# EAGLE schematic RFID (EAGLE 8.3.1)
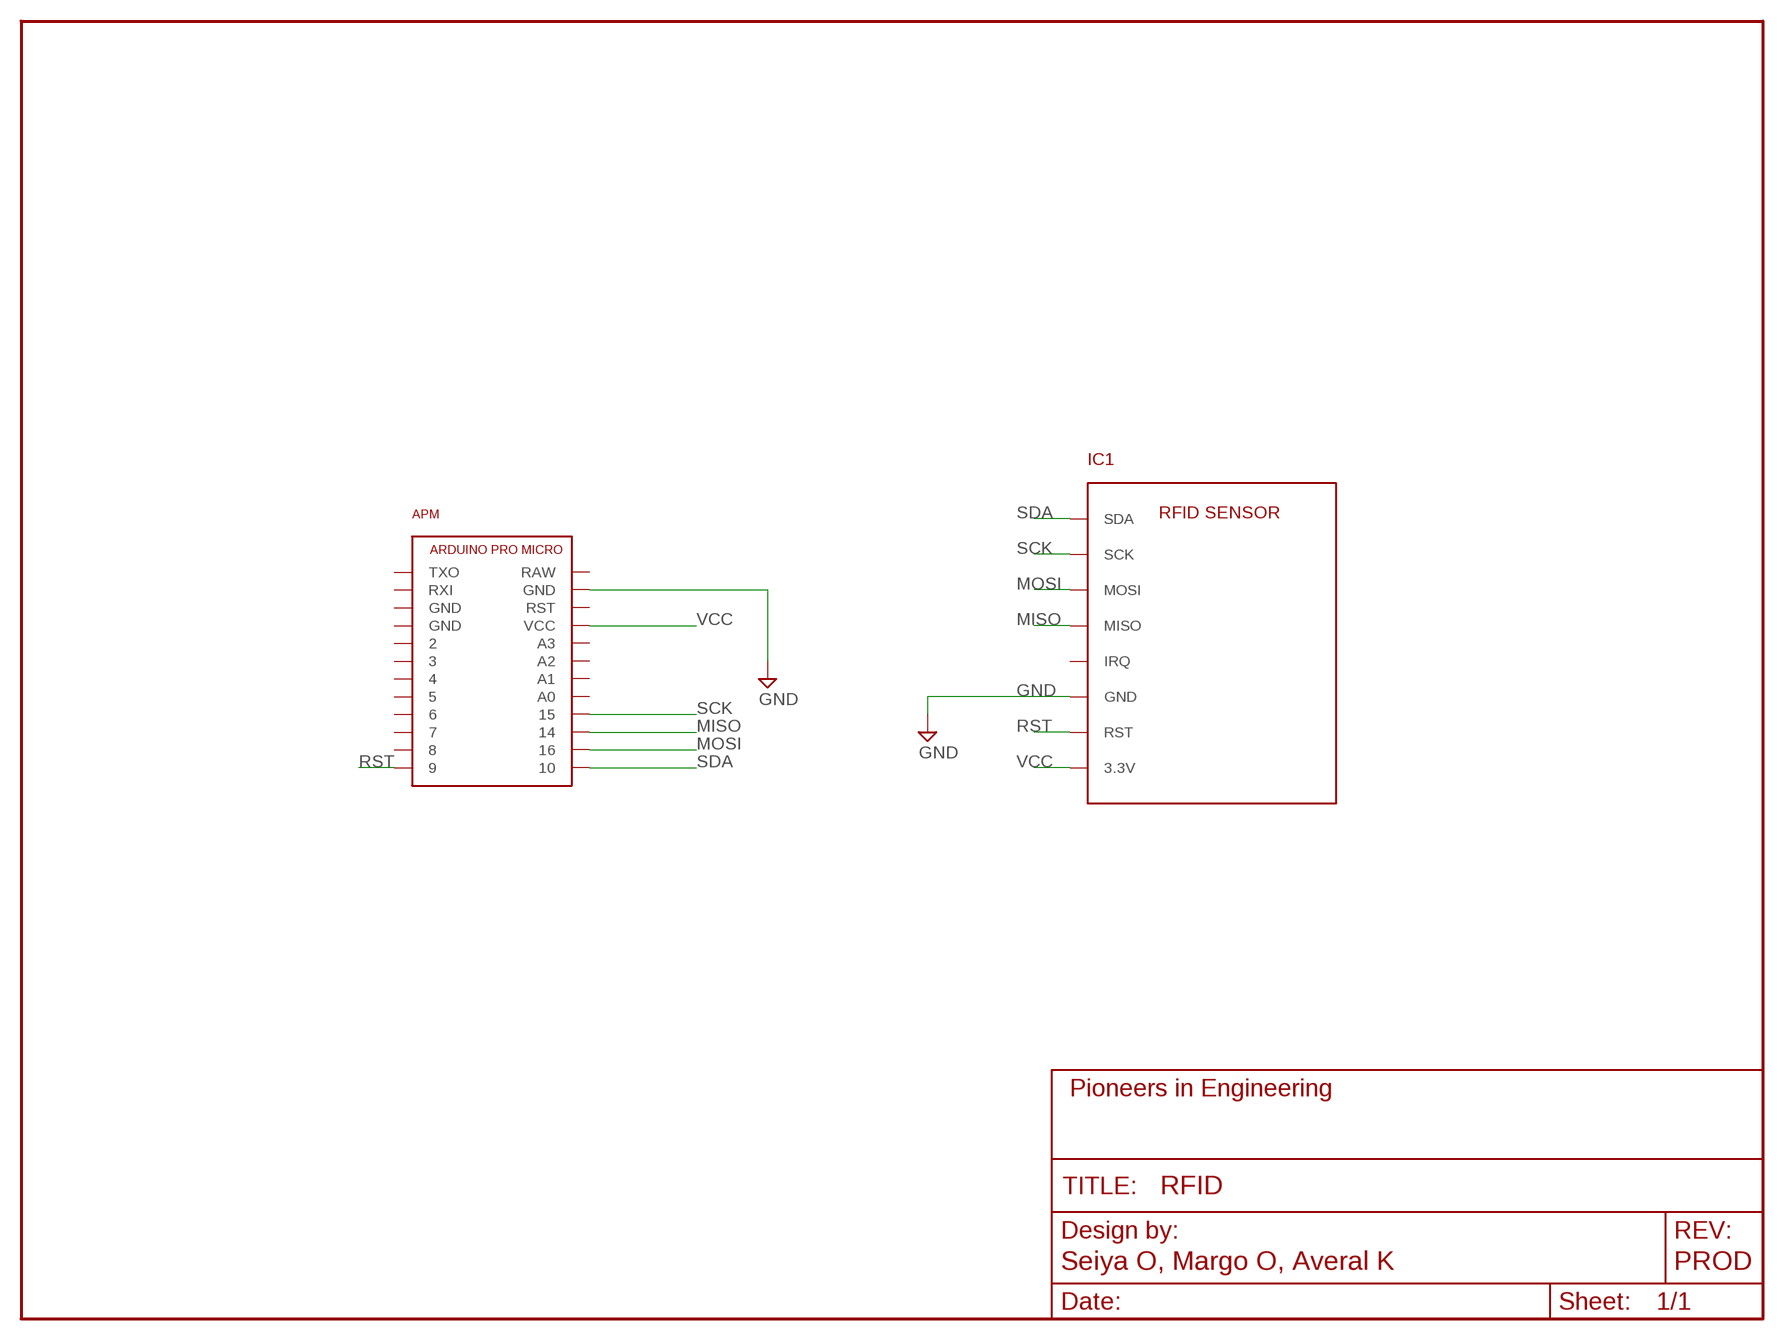
[diagram p0: schematic, sheet 1]
FRAME1 (FRAME_SCHEMATIC): AUTHOR: Seiya O, Margo O, Averal K; REVISION: PROD

## Parts
APM  ARDUINO_PRO_MICRO  [ARDUINO_PRO_MICRO]
IC1  RFID_SENSOR  [RFID_SENSOR]

## Nets
GND: APM.GND@2(GND) IC1.GND
MISO: APM.14 IC1.MISO
MOSI: APM.16 IC1.MOSI
RST: APM.9 IC1.RST
SCK: APM.15 IC1.SCK
SDA: APM.10 IC1.SDA
VCC: APM.VCC IC1.3.3V
Unconnected: APM.2 APM.3 APM.4 APM.5 APM.6 APM.7 APM.8 APM.A0 APM.A1 APM.A2 APM.A3 APM.GND@0(GND) APM.GND@1(GND) APM.RAW APM.RST APM.RXI APM.TXO IC1.IRQ

## Library data of the parts
APM = pie:ARDUINO_PRO_MICRO: Arduino Pro Micro Electrical System Year 9's Smart Sensor Core Pin Outs <https://cdn.sparkfun.com/assets/9/c/3/c/4/523a1765757b7f5c6e8b4567.png> Buy Here <http://www.aliexpress.com/item/Mini-Leonardo-Pro-Micro-ATmega32U4-5V-16MHz-Module-For-Arduino-Best-Quality/32284746884.html?ws_ab_test=searchweb201556_8,searchweb201602_2_10057_10056_10065_10055_10054_10067_10069_10059_10058_10017_10070_10060_10061_10052_10062_10053_10050_10051,searchweb201603_1&btsid=45993952-29ca-4de4-a0fb-c7fb72b8e1a5> Thru Hole Female Pins <http://www.digikey.com/product-search/en?keywords=929974E-01-12-ND> Surface Mount Female Pins <http://www.digikey.com/product-detail/en/sullins-connector-solutions/NPTC121KFXC-RC/S5604-ND/776062>; DESCRIPTION: Arduino Pro Micro; DISTRIBUTOR: AliExpress; DISTRIBUTOR_PART_NUMBER: 32284746884; MANUFACTURER: Feiyang electronics; NOTES: https://www.aliexpress.com/item/Mini-Leonardo-Pro-Micro-ATmega32U4-5V-16MHz-Module-For-Arduino-Best-Quality/32284746884.html?ws_ab_test=searchweb201556_8,searchweb201602_2_10057_10056_10065_10055_10054_10067_10069_10059_10058_10017_10070_10060_10061_10052_10062_10053_10050_10051,searchweb201603_1&btsid=45993952-29ca-4de4-a0fb-c7fb72b8e1a5; PACKAGE: ARDUINO_PRO_MICRO; REFERENCE_DEST: ARDUINO_PRO_MICRO
IC1 = pie:RFID_SENSOR: RFID Sensor AliExpress <https://www.aliexpress.com/item/High-Quality-MFRC-522-RC522-RFID-Reader-RF-IC-Card-Inductive-Sensor-Module-For-Arduino-Module/32657638702.html?spm=2114.01010208.3.1.ePefNj&ws_ab_test=searchweb201556_0%2Csearchweb201602_5_10057_10056_10065_10068_10055_10067_10054_10069_10059_10058_418_10073_10017_10070_10060_10061_10052_10062_10053_10050_10051%2Csearchweb201603_7&btsid=cb39fcb9-9ace-4eec-a43a-83949f44e6b2>; DISTRIBUTOR: AliExpress; DISTRIBUTOR_PART_NUMBER: 32657638702; MANUFACTURER: Binling Gooding; NOTES: https://www.aliexpress.com/item/High-Quality-MFRC-522-RC522-RFID-Reader-RF-IC-Card-Inductive-Sensor-Module-For-Arduino-Module/32657638702.html?spm=2114.01010208.3.1.ePefNj&ws_ab_test=searchweb201556_0%2Csearchweb201602_5_10057_10056_10065_10068_10055_10067_10054_10069_10059_10058_418_10073_10017_10070_10060_10061_10052_10062_10053_10050_10051%2Csearchweb201603_7&btsid=cb39fcb9-9ace-4eec-a43a-83949f44e6b2; PACKAGE: RFID_SENSOR